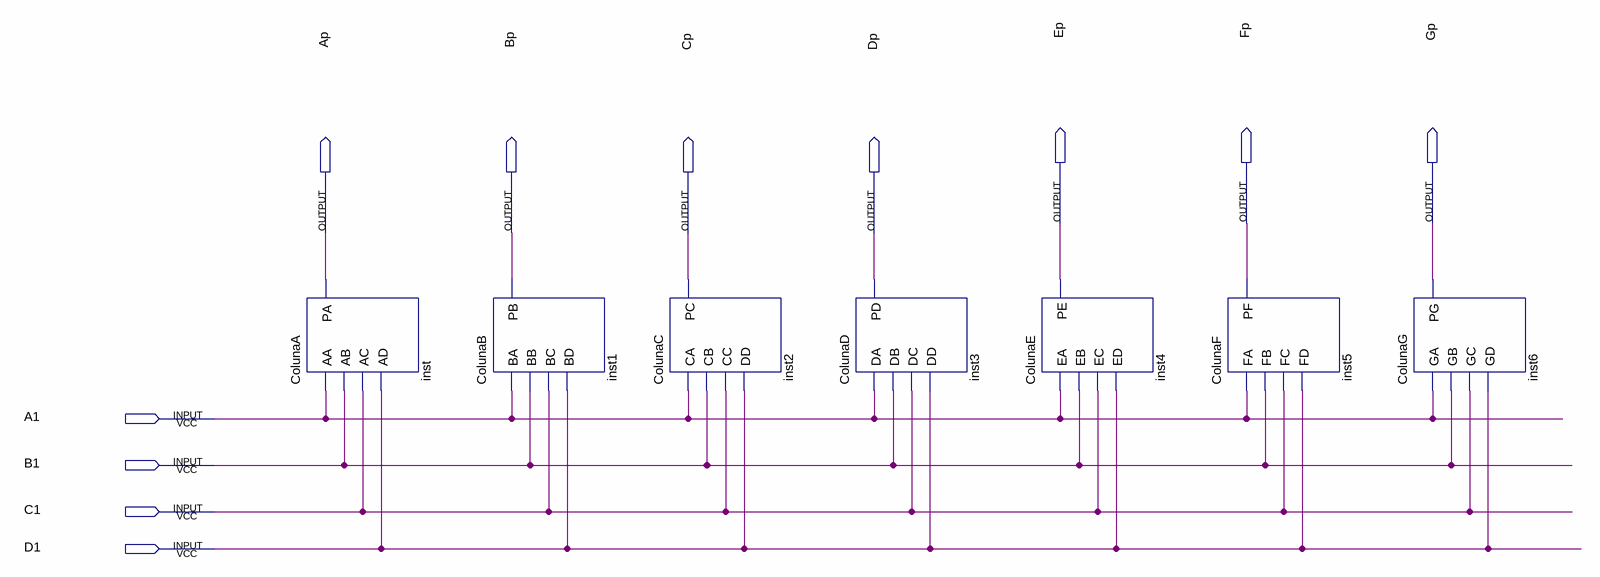
[diagram p0: schematic sheet]
// Quartus schematic DemultiplexadorColuna.bdf as structural Verilog: 7 symbols, 11 pins
module DemultiplexadorColuna (
  input  A1,
  input  B1,
  input  C1,
  input  D1,
  output Ep,
  output Fp,
  output Gp,
  output Ap,
  output Bp,
  output Cp,
  output Dp
);

  ColunaA inst (.AA(A1), .AB(B1), .AC(C1), .AD(D1), .PA(Ap));
  ColunaB inst1 (.BA(A1), .BB(B1), .BC(C1), .BD(D1), .PB(Bp));
  ColunaC inst2 (.CA(A1), .CB(B1), .CC(C1), .DD(D1), .PC(Cp));
  ColunaD inst3 (.DA(A1), .DB(B1), .DC(C1), .DD(D1), .PD(Dp));
  ColunaE inst4 (.EA(A1), .EB(B1), .EC(C1), .ED(D1), .PE(Ep));
  ColunaF inst5 (.FA(A1), .FB(B1), .FC(C1), .FD(D1), .PF(Fp));
  ColunaG inst6 (.GA(A1), .GB(B1), .GC(C1), .GD(D1), .PG(Gp));
endmodule
